# EAGLE schematic Esquema (EAGLE 6.0)
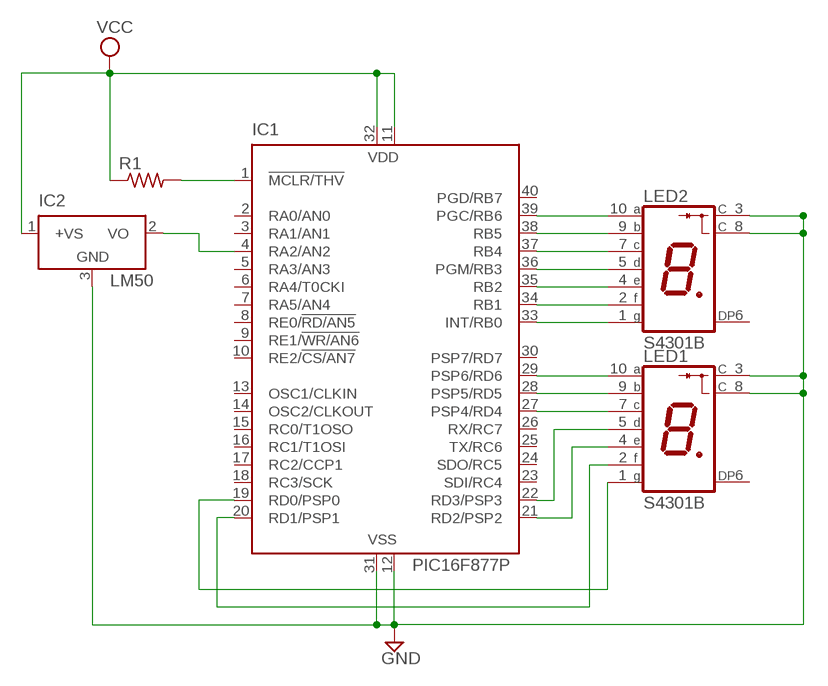
[diagram p0: schematic, sheet 1]

## Parts
IC1  PIC16F877P  [DIL40]
IC2  LM50  [SOT23]
LED1  S4301B  [S4301B]
LED2  S4301B  [S4301B]
R1  R-US_0204/2V  [0204V]

## Nets
GND: IC1.12(VSS) IC1.31(VSS) IC2.3(GND) LED1.3(C) LED1.8(C) LED2.3(C) LED2.8(C)
N$1: IC1.1(!MCLR/THV) R1.2
N$2: IC1.33(INT/RB0) LED2.1(G)
N$3: IC1.4(RA2/AN2) IC2.2(VO)
N$4: IC1.34(RB1) LED2.2(F)
N$5: IC1.35(RB2) LED2.4(E)
N$6: IC1.36(PGM/RB3) LED2.5(D)
N$7: IC1.37(RB4) LED2.7(C)
N$8: IC1.38(RB5) LED2.9(B)
N$9: IC1.39(PGC/RB6) LED2.10(A)
N$10: IC1.19(RD0/PSP0) LED1.1(G)
N$11: IC1.20(RD1/PSP1) LED1.2(F)
N$12: IC1.21(RD2/PSP2) LED1.4(E)
N$13: IC1.22(RD3/PSP3) LED1.5(D)
N$14: IC1.27(PSP4/RD4) LED1.7(C)
N$15: IC1.28(PSP5/RD5) LED1.9(B)
N$16: IC1.29(PSP6/RD6) LED1.10(A)
VCC: IC1.11(VDD) IC1.32(VDD) IC2.1(+VS) R1.1
Unconnected: IC1.2(RA0/AN0) IC1.3(RA1/AN1) IC1.5(RA3/AN3) IC1.6(RA4/T0CKI) IC1.7(RA5/AN4) IC1.8(RE0/!RD/AN5) IC1.9(RE1/!WR/AN6) IC1.10(RE2/!CS/AN7) IC1.13(OSC1/CLKIN) IC1.14(OSC2/CLKOUT) IC1.15(RC0/T1OSO) IC1.16(RC1/T1OSI) IC1.17(RC2/CCP1) IC1.18(RC3/SCK) IC1.23(SDI/RC4) IC1.24(SDO/RC5) IC1.25(TX/RC6) IC1.26(RX/RC7) IC1.30(PSP7/RD7) IC1.40(PGD/RB7) LED1.6(DP) LED2.6(DP)

## Library data of the parts
IC1 = microchip:PIC16F87*: MICROCONTROLLER; MF: MICROCHIP; MPN: PIC16F877-04/P; OC_FARNELL: 9761349; OC_NEWARK: 61K3463
IC2 = linear:LM50: SOT-23 Single-Supply Centigrade Temperature Sensor Vout = (10mV/°C x Temp °C) +5mmmV Source: http://cache.national.com/ds/LM/LM50.pdf
LED1 LED2 = led-7-segment:S4301B: Single Digit Seven-Segment Display (cathode common) Source: LITEON .. S4301B.pdf; OC_FARNELL: unknown; OC_NEWARK: unknown
R1 = rcl:R-US_: RESISTOR, American symbol